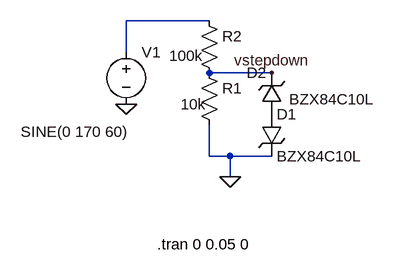
[diagram p0: schematic overvoltProtection.asc]
overvoltProtection.asc, the LTspice schematic file:
Version 4
SHEET 1 880 680
WIRE 64 16 -64 16
WIRE -64 64 -64 16
WIRE 160 96 64 96
WIRE 64 224 64 176
WIRE 96 224 64 224
WIRE 160 224 96 224
WIRE 96 256 96 224
FLAG 96 256 0
FLAG -64 144 0
FLAG 160 96 vstepdown
SYMBOL zener 144 160 R0
SYMATTR InstName D1
SYMATTR Value BZX84C10L
SYMBOL zener 176 160 R180
WINDOW 0 24 64 Left 2
WINDOW 3 -142 23 Left 2
SYMATTR InstName D2
SYMATTR Value BZX84C10L
SYMBOL res 48 80 R0
WINDOW 3 -28 64 Left 2
SYMATTR InstName R1
SYMATTR Value 10k
SYMBOL res 48 0 R0
WINDOW 3 -46 70 Left 2
SYMATTR InstName R2
SYMATTR Value 100k
SYMBOL voltage -64 48 R0
WINDOW 3 -162 139 Left 2
WINDOW 123 0 0 Left 2
WINDOW 39 0 0 Left 2
SYMATTR InstName V1
SYMATTR Value SINE(0 170 60)
TEXT -16 360 Left 2 !.tran 0 0.05 0

The netlist it stands for:
* overvoltProtection.asc
D1 P001 0 BZX84C10L
D2 P001 vstepdown BZX84C10L
R1 vstepdown 0 10k
R2 N001 vstepdown 100k
V1 N001 0 SINE(0 170 60)
.model D D
.lib standard.dio
.tran 0 0.05 0
.backanno
.end